# EAGLE design Baja Sensors (EAGLE 7.2.0)
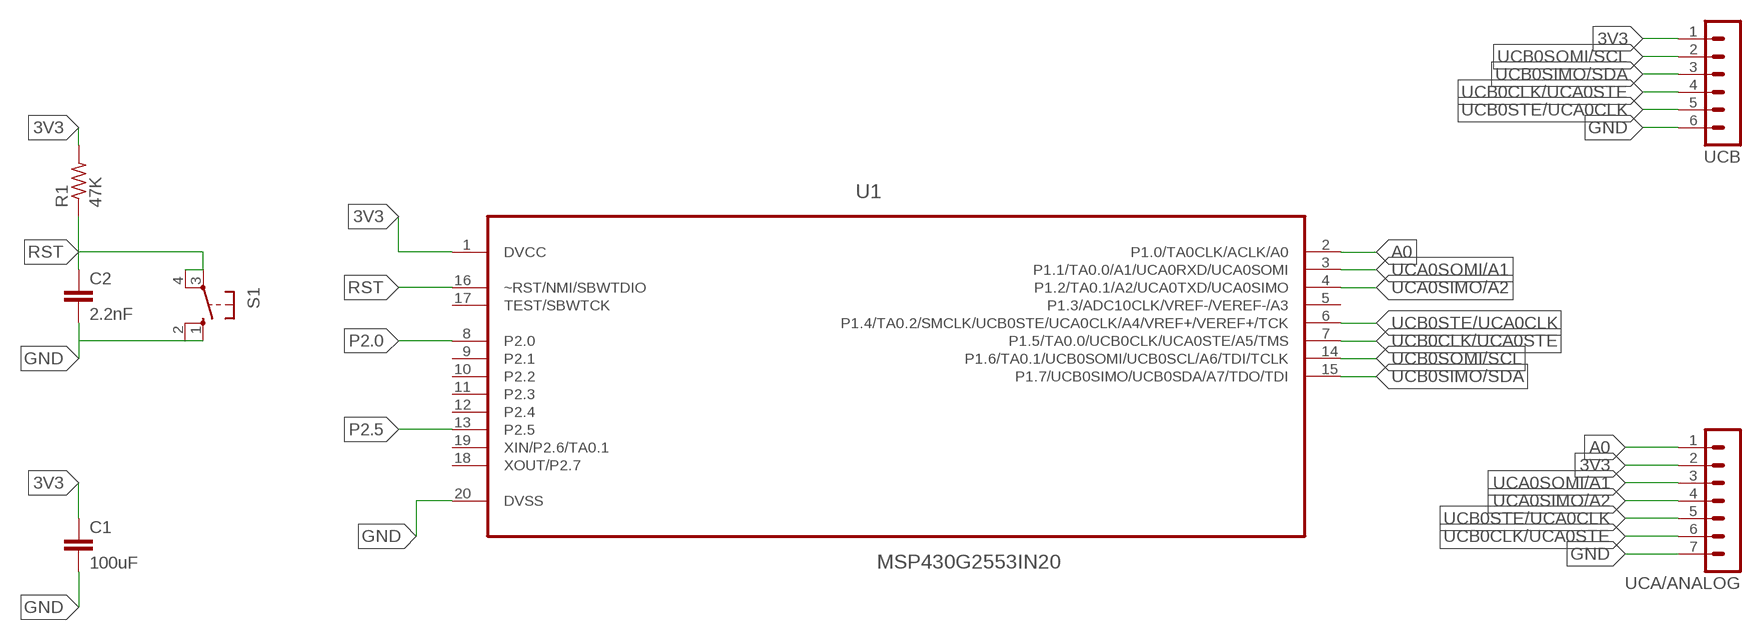
[diagram p0: schematic, sheet 1]

## Parts
C1  100uF  C5/5  [C5B5]
C2  2.2nF  C5/3  [C5B3]
R1  47K  R-US_0207/5V  [0207/5V]
S1  10-XX  [B3F-10XX]
U1  MSP430G2553IN20  [DIP254P762X508-20]
UCA/ANALOG  MA07-1  [MA07-1]
UCB  MA06-1  [MA06-1]

## Nets
3V3: C1.1 R1.2 U1.1(DVCC) UCA/ANALOG.2 UCB.1
A0: U1.2(P1.0/TA0CLK/ACLK/A0) UCA/ANALOG.1
GND: C1.2 C2.2 S1.1(S) S1.2(S1) U1.20(DVSS) UCA/ANALOG.7 UCB.6
P2.0: U1.8(P2.0)
P2.5: U1.13(P2.5)
RST: C2.1 R1.1 S1.3(P) S1.4(P1) U1.16(~RST/NMI/SBWTDIO)
UCA0SIMO/A2: U1.4(P1.2/TA0.1/A2/UCA0TXD/UCA0SIMO) UCA/ANALOG.4
UCA0SOMI/A1: U1.3(P1.1/TA0.0/A1/UCA0RXD/UCA0SOMI) UCA/ANALOG.3
UCB0CLK/UCA0STE: U1.7(P1.5/TA0.0/UCB0CLK/UCA0STE/A5/TMS) UCA/ANALOG.6 UCB.4
UCB0SIMO/SDA: U1.15(P1.7/UCB0SIMO/UCB0SDA/A7/TDO/TDI) UCB.3
UCB0SOMI/SCL: U1.14(P1.6/TA0.1/UCB0SOMI/UCB0SCL/A6/TDI/TCLK) UCB.2
UCB0STE/UCA0CLK: U1.6(P1.4/TA0.2/SMCLK/UCB0STE/UCA0CLK/A4/VREF+/VEREF+/TCK) UCA/ANALOG.5 UCB.5
Unconnected: U1.5(P1.3/ADC10CLK/VREF-/VEREF-/A3) U1.9(P2.1) U1.10(P2.2) U1.11(P2.3) U1.12(P2.4) U1.17(TEST/SBWTCK) U1.18(XOUT/P2.7) U1.19(XIN/P2.6/TA0.1)

## Library data of the parts
C1 C2 = capacitor-wima:C: CAPACITOR naming: grid - package width
R1 = rcl:R-US_: RESISTOR, American symbol
S1 = switch-omron:10-XX: OMRON SWITCH; MPN: B3F-1000; OC_FARNELL: 176432; OC_NEWARK: 36M3542
U1 = baja:MSP430G2553IN20: MIXED SIGNAL MICROCONTROLLER; MPN: MSP430G2332IN20; OC_FARNELL: 1866890; OC_NEWARK: 24T4694; PACKAGE: PDIP-20; SUPPLIER: Texas Instruments
UCA/ANALOG = con-lstb:MA07-1: PIN HEADER; OC_FARNELL: unknown; OC_NEWARK: unknown
UCB = con-lstb:MA06-1: PIN HEADER; OC_FARNELL: unknown; OC_NEWARK: unknown

## Board
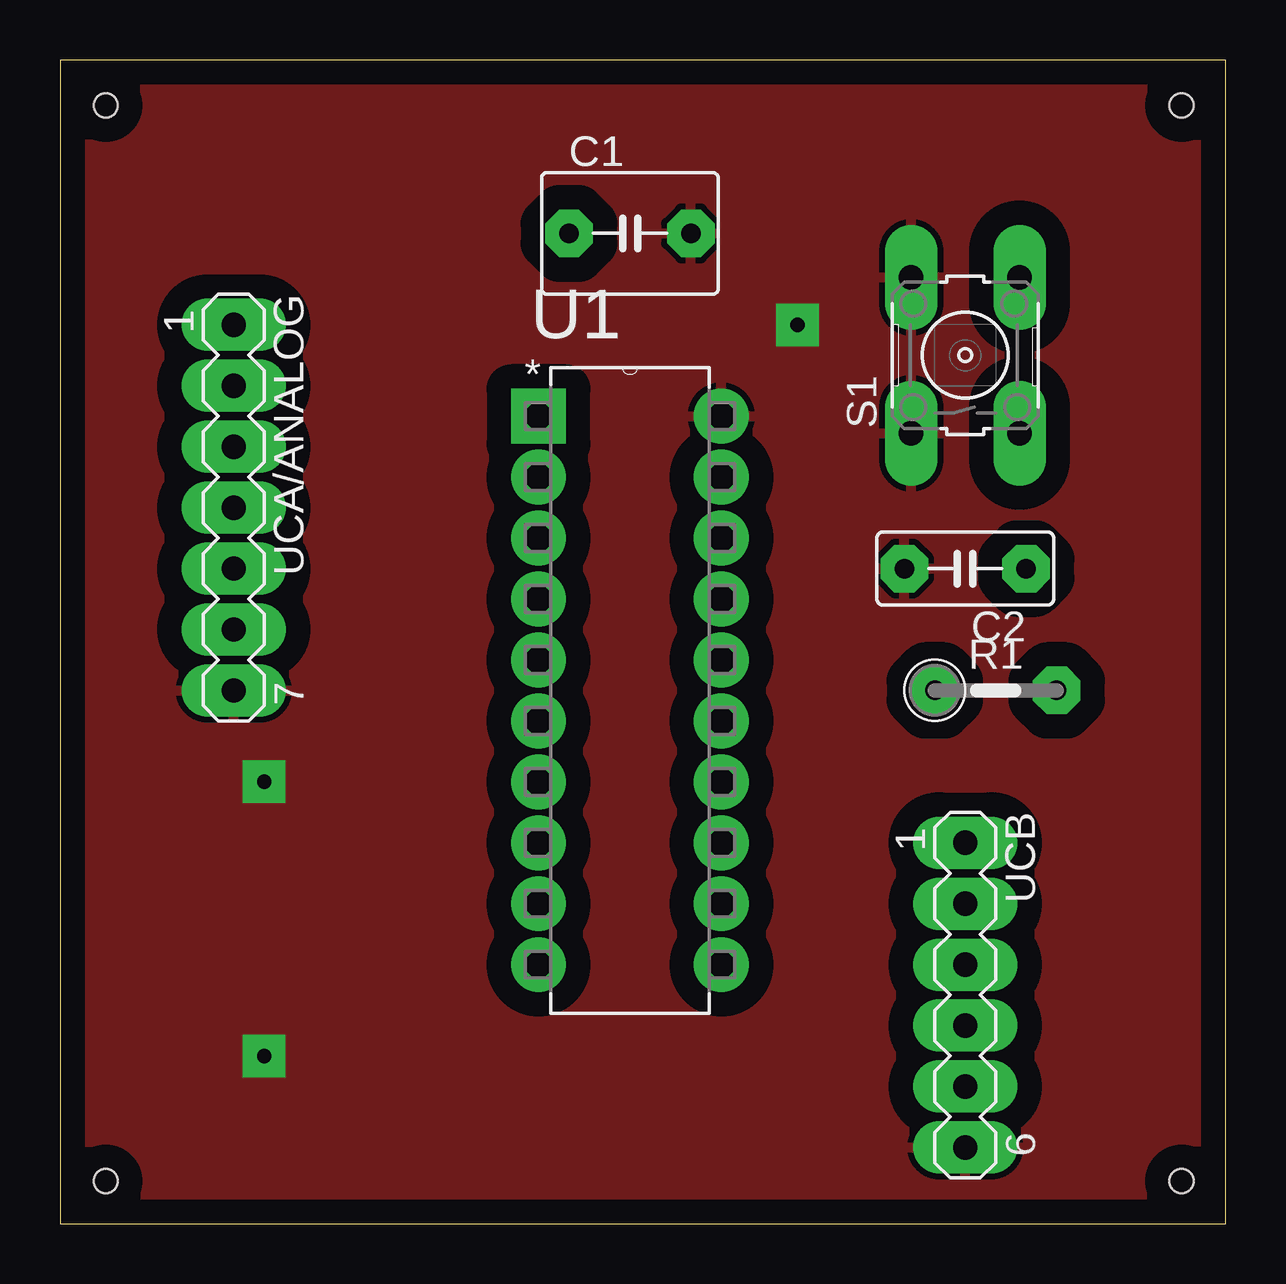
[diagram p1: board, top side]
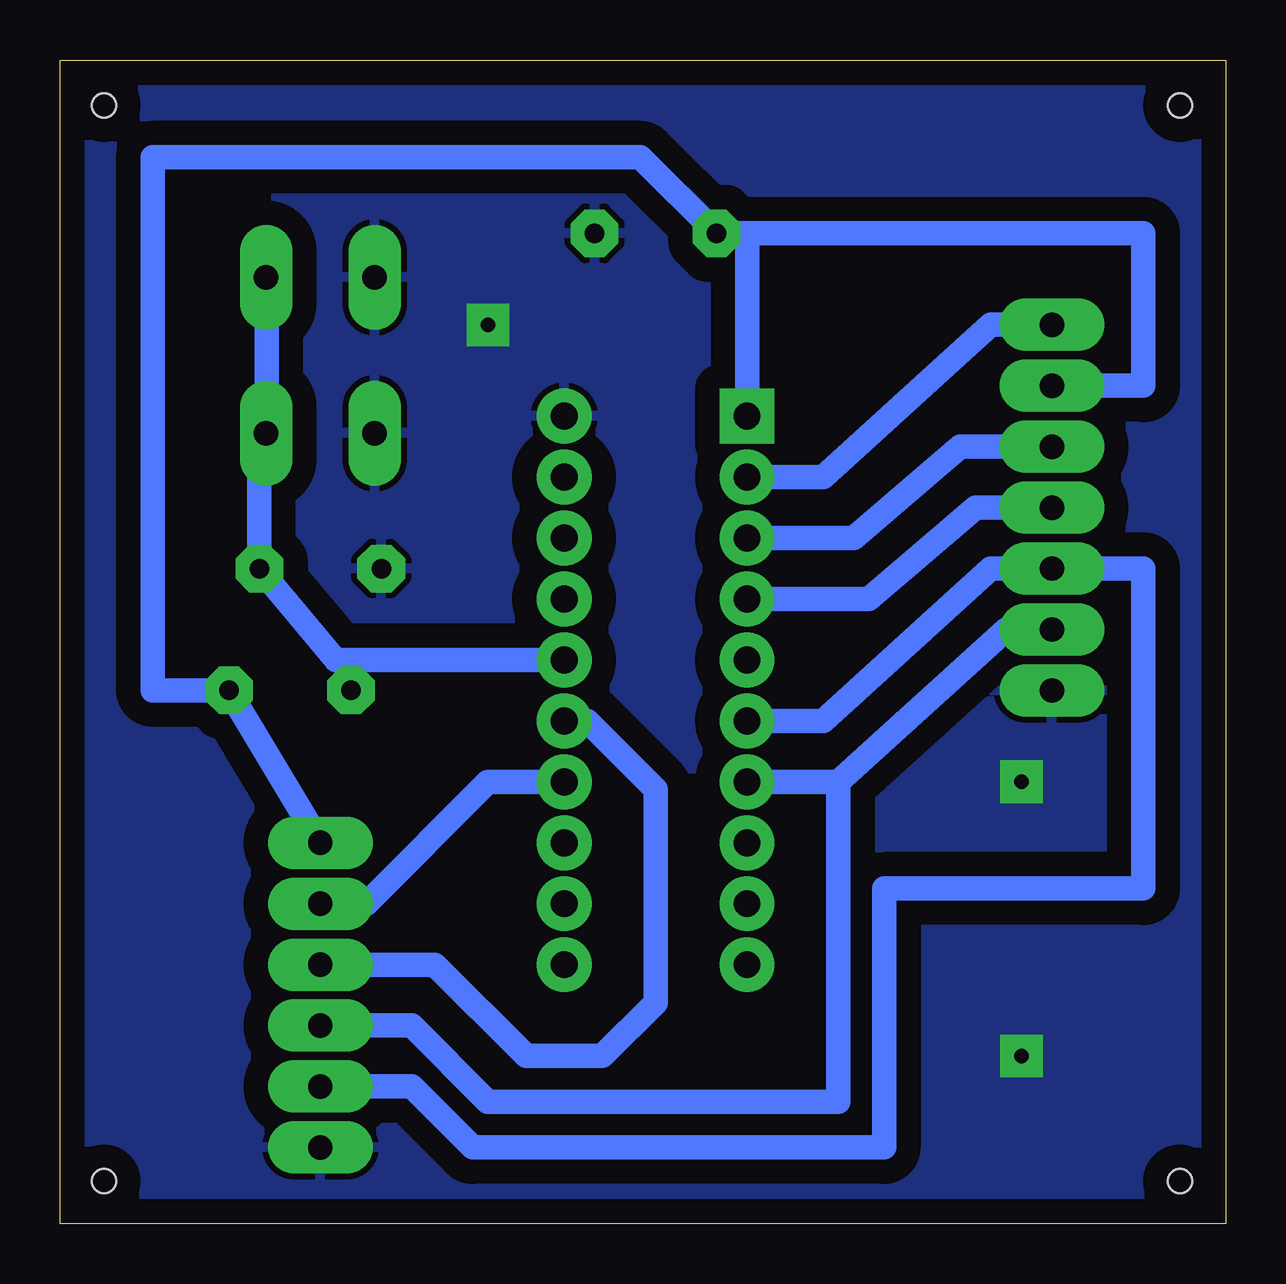
[diagram p2: board, bottom side, seen from below]

Size 48.56 x 48.5 mm. Coordinates in mm from the lower left corner, seen from the top.
Outline: 0,0 48.56,0 48.56,48.5 0,48.5 0,0
Copper layers (1*16): Top 0.035mm / dielectric 1.5mm / Bottom 0.035mm
Design rules "default *": minimum track width 40mil, minimum drill 24mil, track to track 40mil, track to pad 40mil, pad to pad 40mil, via to via 40mil, smd to smd 40mil, copper to edge 40mil, drill to drill 40mil, minimum pad ring 23mil, minimum via ring 23mil, stop-mask expansion 4mil, vias tented up to drill 0mil, thermal gap 10mil
Holes 1 mm at 1.91,1.78 46.74,1.78 46.74,46.61 1.91,46.61

### Footprints (pad centres in the part's own frame; a part is rotated, then mirrored left to right if it is on the bottom)
C5B5 = drill 0.813 pad 1.6 octagon: 1 -2.54,0; 2 2.54,0
C5B3 = drill 0.813 pad 1.6 octagon: 1 -2.54,0; 2 2.54,0
0207/5V = drill 0.813 octagon: 1 -2.54,0; 2 2.54,0
B3F-10XX = drill 1.016 long: 1 -3.251,2.261; 2 3.251,2.261; 3 -3.251,-2.261; 4 3.251,-2.261
DIP254P762X508-20 = drill 1.118 square: 1 -7.62,22.86 | drill 1.118: 2 -7.62,20.32; 3 -7.62,17.78; 4 -7.62,15.24; 5 -7.62,12.7; 6 -7.62,10.16; 7 -7.62,7.62; 8 -7.62,5.08; 9 -7.62,2.54; 10 -7.62,0; 11 0,0; 12 0,2.54; 13 0,5.08; 14 0,7.62; 15 0,10.16; 16 0,12.7; 17 0,15.24; 18 0,17.78; 19 0,20.32; 20 0,22.86
MA07-1 = drill 1.016 long: 1 -7.62,0; 2 -5.08,0; 3 -2.54,0; 4 0,0; 5 2.54,0; 6 5.08,0; 7 7.62,0
MA06-1 = drill 1.016 long: 1 -6.35,0; 2 -3.81,0; 3 -1.27,0; 4 1.27,0; 5 3.81,0; 6 6.35,0

### Placement (x,y rotation side)
C1  23.75,41.27 0 top
C2  37.72,27.3 180 top
R1  38.99,22.23 0 top
S1  37.72,36.2 90 top
U1  27.56,10.79 0 top
UCA/ANALOG  7.24,29.84 270 top
UCB  37.72,9.53 270 top

### Tracks (layer width: path | path; a pad name or v marks a point on that pad's centre or on a via)
3V3
  Bottom 1.016: 19.94,41.27 3.43,41.27 3.43,34.92 UCA/ANALOG.2 | 19.3,33.66 U1.1 19.94,41.27 | 19.94,41.27 C1.1 24.38,44.45 44.7,44.45 44.7,22.23 R1.2 UCB.1
A0
  Bottom 1.016: UCA/ANALOG.1 9.78,37.47 16.76,31.11 U1.2
GND  (via drill 0.6)
  other vias: 8.51,18.41 30.73,37.47 8.51,6.99
  pour Bottom: 0,48.51 48.51,48.51 48.51,0 0,0
  pour Top: 0,48.51 48.51,48.51 48.51,0 0,0
RST
  Bottom 1.016: S1.4 39.94,39.37 39.94,33.34 S1.3 40.26,32.7 C2.1 37.08,23.5 36.45,23.5 | U1.16 36.45,23.5 | R1.1 36.45,23.5
UCA0SIMO/A2
  Bottom 1.016: UCA/ANALOG.4 10.41,29.84 14.86,26.04 U1.4
UCA0SOMI/A1
  Bottom 1.016: UCA/ANALOG.3 11.05,32.38 15.49,28.57 U1.3
UCB0CLK/UCA0STE
  Bottom 1.016: UCA/ANALOG.6 9.14,24.77 16.13,18.41 | U1.7 16.13,18.41 | 16.13,18.41 16.13,5.08 30.73,5.08 33.91,8.26 UCB.4
UCB0SIMO/SDA
  Bottom 1.016: UCB.3 32.96,10.79 29.15,6.99 25.97,6.99 23.75,9.21 23.75,18.1 26.61,20.95 U1.15
UCB0SOMI/SCL
  Bottom 1.016: U1.14 30.73,18.41 35.81,13.34 UCB.2
UCB0STE/UCA0CLK
  Bottom 1.016: U1.6 16.76,20.95 9.78,27.3 UCA/ANALOG.5 3.43,27.3 3.43,13.97 14.22,13.97 14.22,3.17 31.37,3.17 33.91,5.71 UCB.5